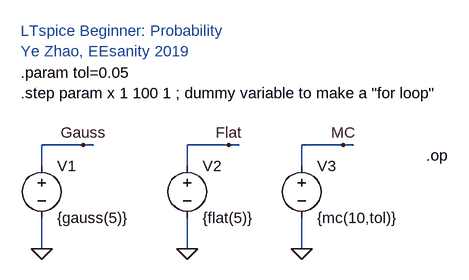
[diagram p0: schematic LTspice 07-1 Probability_ex2.op.asc]
LTspice 07-1 Probability_ex2.op.asc, the LTspice schematic file:
Version 4
SHEET 1 1168 680
WIRE 0 64 -64 64
WIRE 16 64 0 64
WIRE 224 64 160 64
WIRE 240 64 224 64
WIRE 400 64 336 64
WIRE 416 64 400 64
WIRE -64 96 -64 64
WIRE 160 96 160 64
WIRE 336 96 336 64
WIRE -64 224 -64 176
WIRE 160 224 160 176
WIRE 336 224 336 176
FLAG 336 224 0
FLAG 400 64 MC
FLAG -64 224 0
FLAG 0 64 Gauss
FLAG 160 224 0
FLAG 224 64 Flat
SYMBOL voltage 336 80 R0
WINDOW 123 0 0 Left 2
WINDOW 39 0 0 Left 2
SYMATTR InstName V3
SYMATTR Value {mc(10,tol)}
SYMBOL voltage -64 80 R0
WINDOW 123 0 0 Left 2
WINDOW 39 0 0 Left 2
SYMATTR InstName V1
SYMATTR Value {gauss(5)}
SYMBOL voltage 160 80 R0
WINDOW 123 0 0 Left 2
WINDOW 39 0 0 Left 2
SYMATTR InstName V2
SYMATTR Value {flat(5)}
TEXT -96 -48 Left 2 !.param tol=0.05
TEXT -96 -16 Left 2 !.step param x 1 100 1 ; dummy variable to make a "for loop"
TEXT -96 -112 Left 2 ;LTspice Beginner: Probability\nYe Zhao, EEsanity 2019
TEXT 528 80 Left 2 !.op

The netlist it stands for:
* LTspice 07-1 Probability_ex2.op.asc
V3 MC 0 {mc(10,tol)}
V1 Gauss 0 {gauss(5)}
V2 Flat 0 {flat(5)}
.param tol=0.05
.step param x 1 100 1 ; dummy variable to make a "for loop"
* LTspice Beginner: Probability
* Ye Zhao, EEsanity 2019
.op
.backanno
.end